# EAGLE design LQFP100 Breakout (EAGLE 6.5.0)
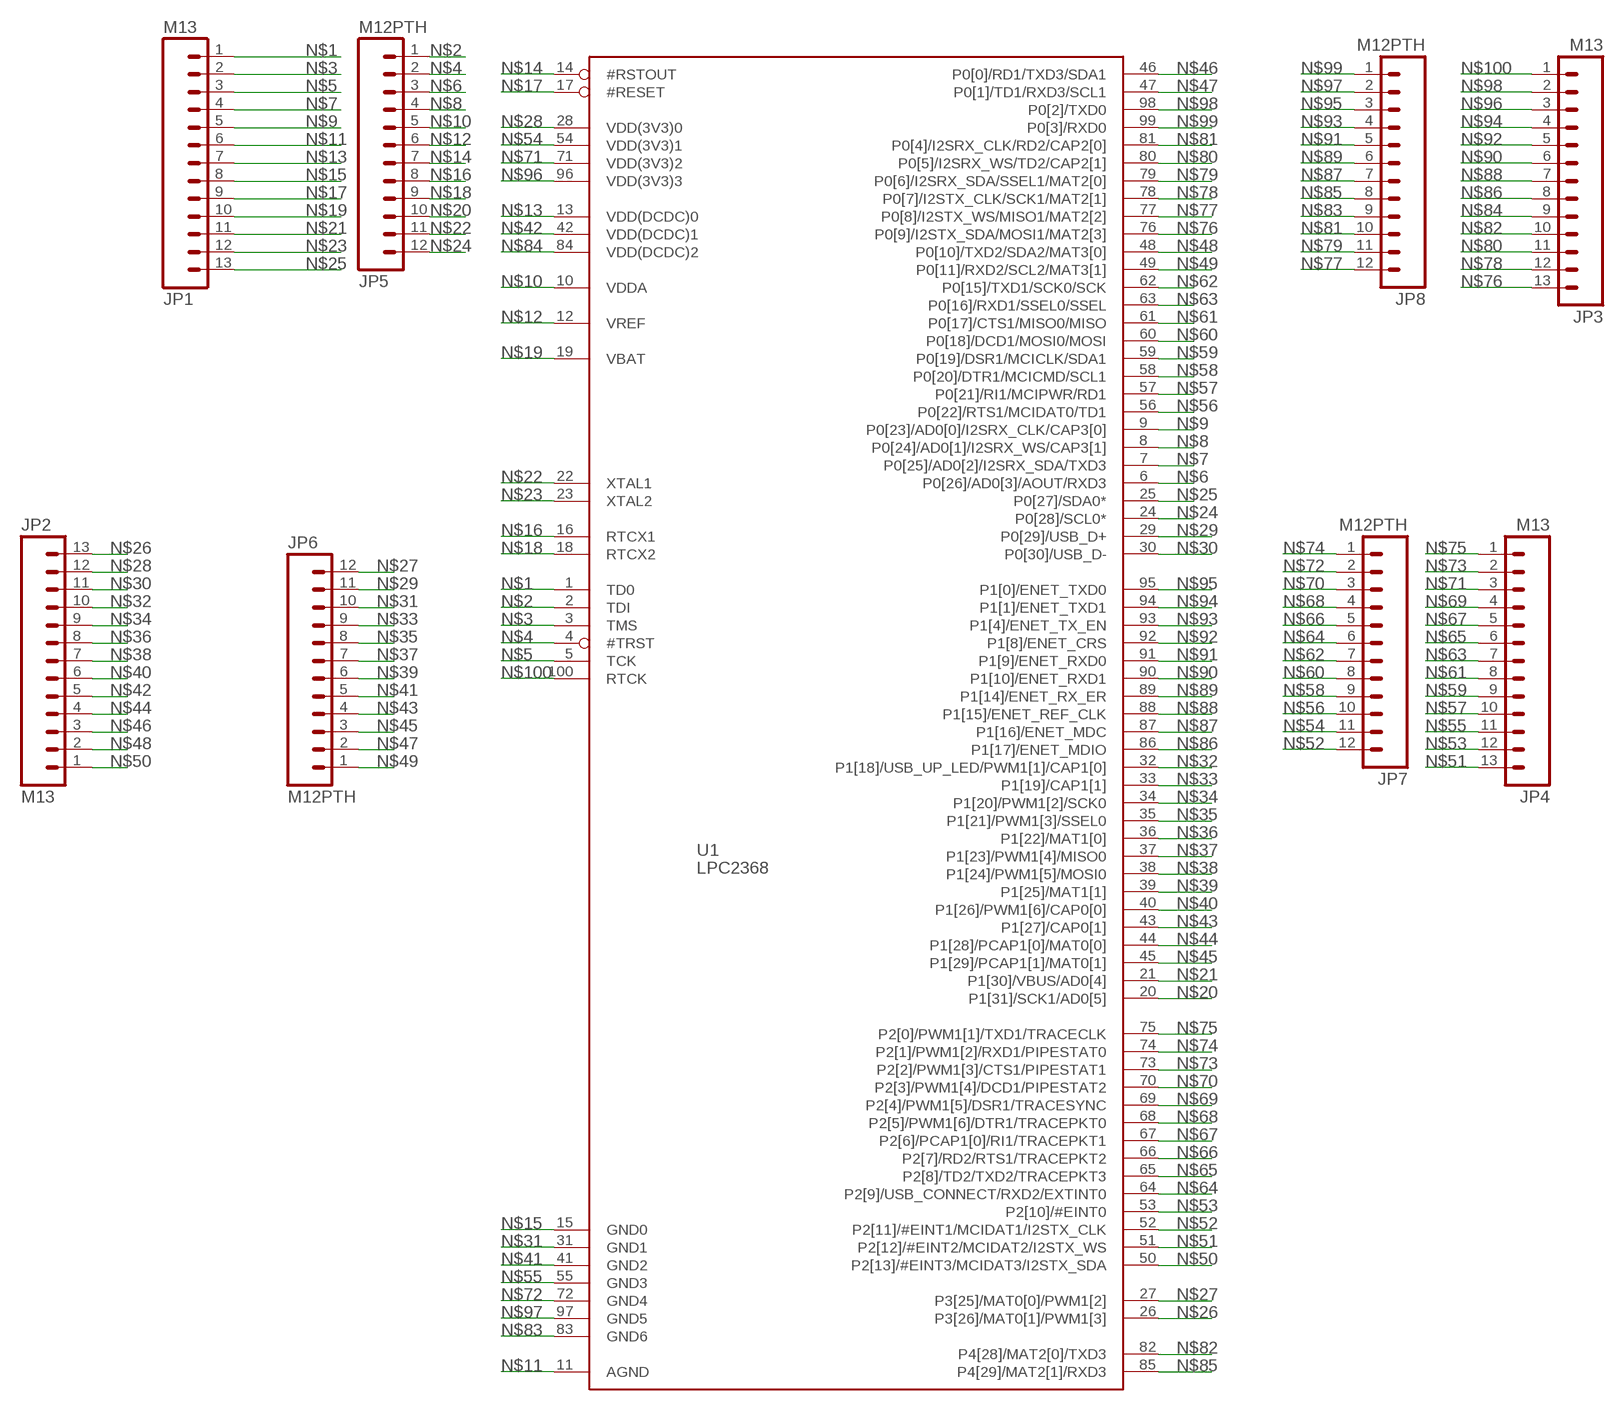
[diagram p0: schematic, sheet 1]

## Parts
JP1  M13  [1X13]
JP2  M13  [1X13]
JP3  M13  [1X13]
JP4  M13  [1X13]
JP5  M12PTH  [1X12]
JP6  M12PTH  [1X12]
JP7  M12PTH  [1X12]
JP8  M12PTH  [1X12]
U1  LPC2368  [LQFP100]

## Nets
N$1: JP1.1 U1.1(TD0)
N$2: JP5.1 U1.2(TDI)
N$3: JP1.2 U1.3(TMS)
N$4: JP5.2 U1.4(#TRST)
N$5: JP1.3 U1.5(TCK)
N$6: JP5.3 U1.6(P0[26]/AD0[3]/AOUT/RXD3)
N$7: JP1.4 U1.7(P0[25]/AD0[2]/I2SRX_SDA/TXD3)
N$8: JP5.4 U1.8(P0[24]/AD0[1]/I2SRX_WS/CAP3[1])
N$9: JP1.5 U1.9(P0[23]/AD0[0]/I2SRX_CLK/CAP3[0])
N$10: JP5.5 U1.10(VDDA)
N$11: JP1.6 U1.11(AGND)
N$12: JP5.6 U1.12(VREF)
N$13: JP1.7 U1.13(VDD(DCDC)0)
N$14: JP5.7 U1.14(#RSTOUT)
N$15: JP1.8 U1.15(GND0)
N$16: JP5.8 U1.16(RTCX1)
N$17: JP1.9 U1.17(#RESET)
N$18: JP5.9 U1.18(RTCX2)
N$19: JP1.10 U1.19(VBAT)
N$20: JP5.10 U1.20(P1[31]/SCK1/AD0[5])
N$21: JP1.11 U1.21(P1[30]/VBUS/AD0[4])
N$22: JP5.11 U1.22(XTAL1)
N$23: JP1.12 U1.23(XTAL2)
N$24: JP5.12 U1.24(P0[28]/SCL0*)
N$25: JP1.13 U1.25(P0[27]/SDA0*)
N$26: JP2.13 U1.26(P3[26]/MAT0[1]/PWM1[3])
N$27: JP6.12 U1.27(P3[25]/MAT0[0]/PWM1[2])
N$28: JP2.12 U1.28(VDD(3V3)0)
N$29: JP6.11 U1.29(P0[29]/USB_D+)
N$30: JP2.11 U1.30(P0[30]/USB_D-)
N$31: JP6.10 U1.31(GND1)
N$32: JP2.10 U1.32(P1[18]/USB_UP_LED/PWM1[1]/CAP1[0])
N$33: JP6.9 U1.33(P1[19]/CAP1[1])
N$34: JP2.9 U1.34(P1[20]/PWM1[2]/SCK0)
N$35: JP6.8 U1.35(P1[21]/PWM1[3]/SSEL0)
N$36: JP2.8 U1.36(P1[22]/MAT1[0])
N$37: JP6.7 U1.37(P1[23]/PWM1[4]/MISO0)
N$38: JP2.7 U1.38(P1[24]/PWM1[5]/MOSI0)
N$39: JP6.6 U1.39(P1[25]/MAT1[1])
N$40: JP2.6 U1.40(P1[26]/PWM1[6]/CAP0[0])
N$41: JP6.5 U1.41(GND2)
N$42: JP2.5 U1.42(VDD(DCDC)1)
N$43: JP6.4 U1.43(P1[27]/CAP0[1])
N$44: JP2.4 U1.44(P1[28]/PCAP1[0]/MAT0[0])
N$45: JP6.3 U1.45(P1[29]/PCAP1[1]/MAT0[1])
N$46: JP2.3 U1.46(P0[0]/RD1/TXD3/SDA1)
N$47: JP6.2 U1.47(P0[1]/TD1/RXD3/SCL1)
N$48: JP2.2 U1.48(P0[10]/TXD2/SDA2/MAT3[0])
N$49: JP6.1 U1.49(P0[11]/RXD2/SCL2/MAT3[1])
N$50: JP2.1 U1.50(P2[13]/#EINT3/MCIDAT3/I2STX_SDA)
N$51: JP4.13 U1.51(P2[12]/#EINT2/MCIDAT2/I2STX_WS)
N$52: JP7.12 U1.52(P2[11]/#EINT1/MCIDAT1/I2STX_CLK)
N$53: JP4.12 U1.53(P2[10]/#EINT0)
N$54: JP7.11 U1.54(VDD(3V3)1)
N$55: JP4.11 U1.55(GND3)
N$56: JP7.10 U1.56(P0[22]/RTS1/MCIDAT0/TD1)
N$57: JP4.10 U1.57(P0[21]/RI1/MCIPWR/RD1)
N$58: JP7.9 U1.58(P0[20]/DTR1/MCICMD/SCL1)
N$59: JP4.9 U1.59(P0[19]/DSR1/MCICLK/SDA1)
N$60: JP7.8 U1.60(P0[18]/DCD1/MOSI0/MOSI)
N$61: JP4.8 U1.61(P0[17]/CTS1/MISO0/MISO)
N$62: JP7.7 U1.62(P0[15]/TXD1/SCK0/SCK)
N$63: JP4.7 U1.63(P0[16]/RXD1/SSEL0/SSEL)
N$64: JP7.6 U1.64(P2[9]/USB_CONNECT/RXD2/EXTINT0)
N$65: JP4.6 U1.65(P2[8]/TD2/TXD2/TRACEPKT3)
N$66: JP7.5 U1.66(P2[7]/RD2/RTS1/TRACEPKT2)
N$67: JP4.5 U1.67(P2[6]/PCAP1[0]/RI1/TRACEPKT1)
N$68: JP7.4 U1.68(P2[5]/PWM1[6]/DTR1/TRACEPKT0)
N$69: JP4.4 U1.69(P2[4]/PWM1[5]/DSR1/TRACESYNC)
N$70: JP7.3 U1.70(P2[3]/PWM1[4]/DCD1/PIPESTAT2)
N$71: JP4.3 U1.71(VDD(3V3)2)
N$72: JP7.2 U1.72(GND4)
N$73: JP4.2 U1.73(P2[2]/PWM1[3]/CTS1/PIPESTAT1)
N$74: JP7.1 U1.74(P2[1]/PWM1[2]/RXD1/PIPESTAT0)
N$75: JP4.1 U1.75(P2[0]/PWM1[1]/TXD1/TRACECLK)
N$76: JP3.13 U1.76(P0[9]/I2STX_SDA/MOSI1/MAT2[3])
N$77: JP8.12 U1.77(P0[8]/I2STX_WS/MISO1/MAT2[2])
N$78: JP3.12 U1.78(P0[7]/I2STX_CLK/SCK1/MAT2[1])
N$79: JP8.11 U1.79(P0[6]/I2SRX_SDA/SSEL1/MAT2[0])
N$80: JP3.11 U1.80(P0[5]/I2SRX_WS/TD2/CAP2[1])
N$81: JP8.10 U1.81(P0[4]/I2SRX_CLK/RD2/CAP2[0])
N$82: JP3.10 U1.82(P4[28]/MAT2[0]/TXD3)
N$83: JP8.9 U1.83(GND6)
N$84: JP3.9 U1.84(VDD(DCDC)2)
N$85: JP8.8 U1.85(P4[29]/MAT2[1]/RXD3)
N$86: JP3.8 U1.86(P1[17]/ENET_MDIO)
N$87: JP8.7 U1.87(P1[16]/ENET_MDC)
N$88: JP3.7 U1.88(P1[15]/ENET_REF_CLK)
N$89: JP8.6 U1.89(P1[14]/ENET_RX_ER)
N$90: JP3.6 U1.90(P1[10]/ENET_RXD1)
N$91: JP8.5 U1.91(P1[9]/ENET_RXD0)
N$92: JP3.5 U1.92(P1[8]/ENET_CRS)
N$93: JP8.4 U1.93(P1[4]/ENET_TX_EN)
N$94: JP3.4 U1.94(P1[1]/ENET_TXD1)
N$95: JP8.3 U1.95(P1[0]/ENET_TXD0)
N$96: JP3.3 U1.96(VDD(3V3)3)
N$97: JP8.2 U1.97(GND5)
N$98: JP3.2 U1.98(P0[2]/TXD0)
N$99: JP8.1 U1.99(P0[3]/RXD0)
N$100: JP3.1 U1.100(RTCK)

## Library data of the parts
JP1-JP4 = SparkFun-Connectors:M13: 13-pin single row .1" header
JP5-JP8 = SparkFun-Connectors:M12: Header 12 Standard 12-pin 0.1" header. Use with straight break away headers (SKU : PRT-00116), right angle break away headers (PRT-00553), swiss pins (PRT-00743), machine pins (PRT-00117), and female headers (PRT-00115).
U1 = KwanSystems:LPC2368

## Board
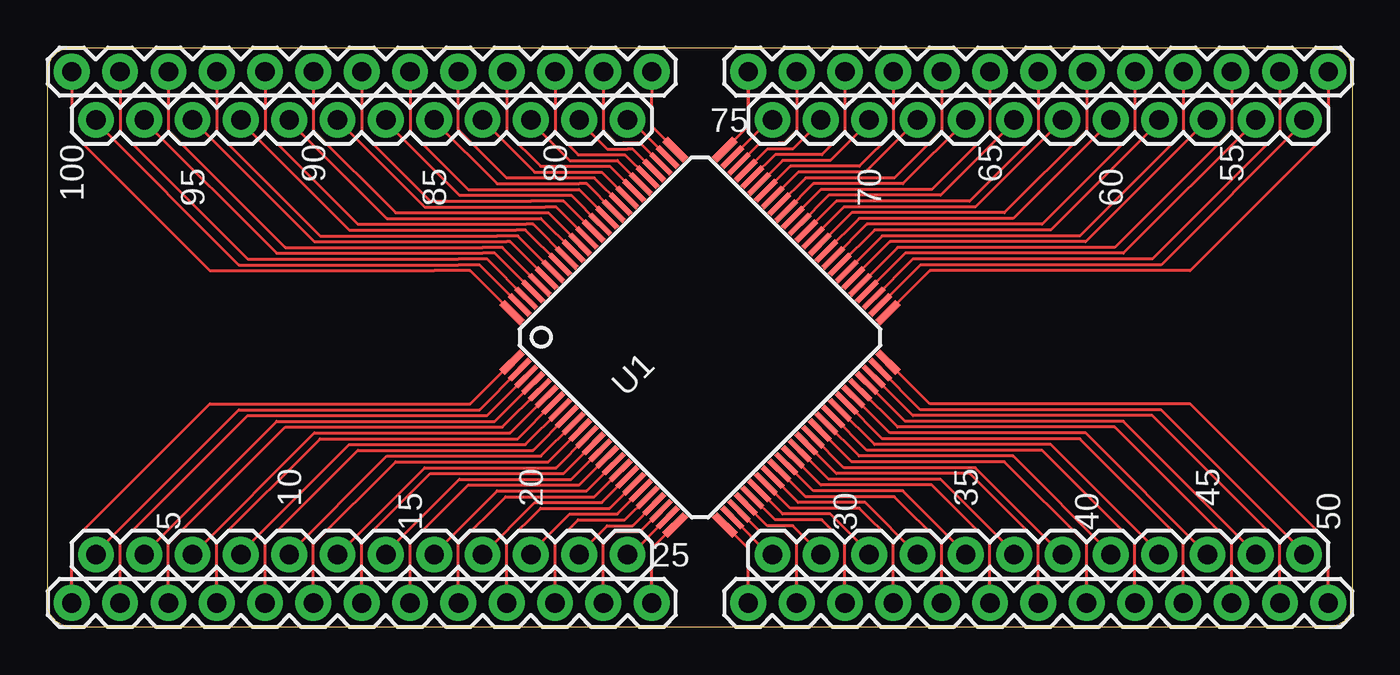
[diagram p1: board, top side]

Size 68.58 x 30.48 mm. Coordinates in mm from the lower left corner, seen from the top.
Outline: 1.27,30.48 67.31,30.48 arc-90 68.58,29.21 68.58,1.27 arc-90 67.31,0 1.27,0 arc-90 0,1.27 0,29.21 arc-90 1.27,30.48
Copper layers (1*16): Top 0.0356mm / dielectric 1.5011mm / Bottom 0.0356mm
Design rules "default": minimum track width 6mil, minimum drill 13mil, track to track 6mil, track to pad 6mil, pad to pad 6mil, via to via 6mil, smd to smd 6mil, copper to edge 15mil, drill to drill 6mil, minimum pad ring 7mil, minimum via ring 7mil, stop-mask expansion 4mil, vias tented up to drill 0mil, thermal gap 10mil

### Footprints (pad centres in the part's own frame; a part is rotated, then mirrored left to right if it is on the bottom)
1X13 = drill 1.016 pad 1.88: 1 0,0; 2 2.54,0; 3 5.08,0; 4 7.62,0; 5 10.16,0; 6 12.7,0; 7 15.24,0; 8 17.78,0; 9 20.32,0; 10 22.86,0; 11 25.4,0; 12 27.94,0; 13 30.48,0
1X12 = drill 1.016 pad 1.88: 1 0,0; 2 2.54,0; 3 5.08,0; 4 7.62,0; 5 10.16,0; 6 12.7,0; 7 15.24,0; 8 17.78,0; 9 20.32,0; 10 22.86,0; 11 25.4,0; 12 27.94,0
LQFP100 = smd 1.5 x 0.4: 1 -7.9,6.06; 25 -7.9,-6.06; 51 7.9,-6.06; 75 7.9,6.06 | smd 1.5 x 0.28: 2 -7.9,5.5; 3 -7.9,5; 4 -7.9,4.5; 5 -7.9,4; 6 -7.9,3.5; 7 -7.9,3; 8 -7.9,2.5; 9 -7.9,2; 10 -7.9,1.5; 11 -7.9,1; 12 -7.9,0.5; 13 -7.9,0; 14 -7.9,-0.5; 15 -7.9,-1; 16 -7.9,-1.5; 17 -7.9,-2; 18 -7.9,-2.5; 19 -7.9,-3; 20 -7.9,-3.5; 21 -7.9,-4; 22 -7.9,-4.5; 23 -7.9,-5; 24 -7.9,-5.5; 52 7.9,-5.5; 53 7.9,-5; 54 7.9,-4.5; 55 7.9,-4; 56 7.9,-3.5; 57 7.9,-3; 58 7.9,-2.5; 59 7.9,-2; 60 7.9,-1.5; 61 7.9,-1; 62 7.9,-0.5; 63 7.9,0; 64 7.9,0.5; 65 7.9,1; 66 7.9,1.5; 67 7.9,2; 68 7.9,2.5; 69 7.9,3; 70 7.9,3.5; 71 7.9,4; 72 7.9,4.5; 73 7.9,5; 74 7.9,5.5 | smd 0.4 x 1.5: 26 -6.06,-7.9; 50 6.06,-7.9; 76 6.06,7.9; 100 -6.06,7.9 | smd 0.28 x 1.5: 27 -5.5,-7.9; 28 -5,-7.9; 29 -4.5,-7.9; 30 -4,-7.9; 31 -3.5,-7.9; 32 -3,-7.9; 33 -2.5,-7.9; 34 -2,-7.9; 35 -1.5,-7.9; 36 -1,-7.9; 37 -0.5,-7.9; 38 0,-7.9; 39 0.5,-7.9; 40 1,-7.9; 41 1.5,-7.9; 42 2,-7.9; 43 2.5,-7.9; 44 3,-7.9; 45 3.5,-7.9; 46 4,-7.9; 47 4.5,-7.9; 48 5,-7.9; 49 5.5,-7.9; 77 5.5,7.9; 78 5,7.9; 79 4.5,7.9; 80 4,7.9; 81 3.5,7.9; 82 3,7.9; 83 2.5,7.9; 84 2,7.9; 85 1.5,7.9; 86 1,7.9; 87 0.5,7.9; 88 0,7.9; 89 -0.5,7.9; 90 -1,7.9; 91 -1.5,7.9; 92 -2,7.9; 93 -2.5,7.9; 94 -3,7.9; 95 -3.5,7.9; 96 -4,7.9; 97 -4.5,7.9; 98 -5,7.9; 99 -5.5,7.9

### Placement (x,y rotation side)
JP1  1.27,1.27 0 top
JP2  67.31,1.27 180 top
JP3  1.27,29.21 0 top
JP4  36.83,29.21 0 top
JP5  2.54,3.81 0 top
JP6  66.04,3.81 180 top
JP7  38.1,26.67 0 top
JP8  2.54,26.67 0 top
U1  34.29,15.24 45 top

### Tracks (layer width: path | path; a pad name or v marks a point on that pad's centre or on a via)
N$1
  Top 0.152: JP1.1 1.27,4.47 8.53,11.73 22.21,11.73 U1.1
N$2
  Top 0.152: JP5.1 2.54,3.91 10.06,11.43 22.7,11.43 U1.2
N$3
  Top 0.152: JP1.2 3.81,4.42 10.52,11.12 23.1,11.12 U1.3
N$4
  Top 0.152: JP5.2 5.08,3.86 12.04,10.82 23.51,10.82 U1.4
N$5
  Top 0.152: JP1.3 6.35,4.37 12.5,10.52 23.91,10.52 U1.5
N$6
  Top 0.152: JP5.3 14.02,10.21 24.31,10.21 U1.6
N$7
  Top 0.152: JP1.4 8.89,4.47 14.33,9.91 24.71,9.91 U1.7
N$8
  Top 0.152: JP5.4 10.16,3.91 15.85,9.6 25.12,9.6 U1.8
N$9
  Top 0.152: JP1.5 11.43,4.42 16.31,9.3 25.52,9.3 U1.9
N$10
  Top 0.152: JP5.5 12.7,3.86 17.83,8.99 25.92,8.99 U1.10
N$11
  Top 0.152: JP1.6 13.97,4.37 18.29,8.69 26.32,8.69 U1.11
N$12
  Top 0.152: JP5.6 19.81,8.38 26.73,8.38 U1.12
N$13
  Top 0.152: JP1.7 16.51,4.47 20.12,8.08 27.13,8.08 U1.13
N$14
  Top 0.152: JP5.7 17.78,3.91 21.64,7.77 27.53,7.77 U1.14
N$15
  Top 0.152: JP1.8 19.05,4.42 22.1,7.47 27.93,7.47 U1.15
N$16
  Top 0.152: JP5.8 20.32,3.86 23.62,7.16 28.33,7.16 U1.16
N$17
  Top 0.152: JP1.9 21.59,4.37 24.08,6.86 28.74,6.86 U1.17
N$18
  Top 0.152: JP5.9 25.6,6.55 29.14,6.55 U1.18
N$19
  Top 0.152: JP1.10 24.13,4.47 25.91,6.25 29.54,6.25 U1.19
N$20
  Top 0.152: JP5.10 25.4,3.91 27.43,5.94 29.94,5.94 U1.20
N$21
  Top 0.152: JP1.11 26.67,4.42 27.89,5.64 30.35,5.64 U1.21
N$22
  Top 0.152: JP5.11 27.94,3.86 29.41,5.33 30.75,5.33 U1.22
N$23
  Top 0.152: JP1.12 29.21,4.37 29.87,5.03 31.15,5.03 U1.23
N$24
  Top 0.152: JP5.12 30.64,3.81 U1.24
N$25
  Top 0.152: JP1.13 31.75,4.13 U1.25
N$26
  Top 0.152: JP2.13 36.83,4.13 U1.26
N$27
  Top 0.152: JP6.12 37.94,3.81 U1.27
N$28
  Top 0.152: JP2.12 39.37,4.37 38.71,5.03 37.43,5.03 U1.28
N$29
  Top 0.152: JP6.11 40.64,3.86 39.17,5.33 37.83,5.33 U1.29
N$30
  Top 0.152: JP2.11 41.91,4.42 40.69,5.64 38.23,5.64 U1.30
N$31
  Top 0.152: JP6.10 43.18,3.91 41.15,5.94 38.64,5.94 U1.31
N$32
  Top 0.152: JP2.10 44.45,4.47 42.67,6.25 39.04,6.25 U1.32
N$33
  Top 0.152: JP6.9 42.98,6.55 39.44,6.55 U1.33
N$34
  Top 0.152: JP2.9 46.99,4.37 44.5,6.86 39.84,6.86 U1.34
N$35
  Top 0.152: JP6.8 48.26,3.86 44.96,7.16 40.25,7.16 U1.35
N$36
  Top 0.152: JP2.8 49.53,4.42 46.48,7.47 40.65,7.47 U1.36
N$37
  Top 0.152: JP6.7 50.8,3.91 46.94,7.77 41.05,7.77 U1.37
N$38
  Top 0.152: JP2.7 52.07,4.47 48.46,8.08 41.45,8.08 U1.38
N$39
  Top 0.152: JP6.6 48.77,8.38 41.85,8.38 U1.39
N$40
  Top 0.152: JP2.6 54.61,4.37 50.29,8.69 42.26,8.69 U1.40
N$41
  Top 0.152: JP6.5 55.88,3.86 50.75,8.99 42.66,8.99 U1.41
N$42
  Top 0.152: JP2.5 57.15,4.42 52.27,9.3 43.06,9.3 U1.42
N$43
  Top 0.152: JP6.4 58.42,3.91 52.73,9.6 43.46,9.6 U1.43
N$44
  Top 0.152: JP2.4 59.69,4.47 54.25,9.91 43.87,9.91 U1.44
N$45
  Top 0.152: JP6.3 54.56,10.21 44.27,10.21 U1.45
N$46
  Top 0.152: JP2.3 62.23,4.37 56.08,10.52 44.67,10.52 U1.46
N$47
  Top 0.152: JP6.2 63.5,3.86 56.54,10.82 45.07,10.82 U1.47
N$48
  Top 0.152: JP2.2 64.77,4.42 58.06,11.12 45.48,11.12 U1.48
N$49
  Top 0.152: JP6.1 66.04,3.91 58.52,11.43 45.88,11.43 U1.49
N$50
  Top 0.152: JP2.1 67.31,4.47 60.05,11.73 46.37,11.73 U1.50
N$51
  Top 0.152: JP4.13 67.31,26.01 60.05,18.75 46.37,18.75 U1.51
N$52
  Top 0.152: JP7.12 66.04,26.57 58.52,19.05 45.88,19.05 U1.52
N$53
  Top 0.152: JP4.12 64.77,26.06 58.06,19.36 45.48,19.36 U1.53
N$54
  Top 0.152: JP7.11 63.5,26.62 56.54,19.66 45.07,19.66 U1.54
N$55
  Top 0.152: JP4.11 62.23,26.11 56.08,19.96 44.67,19.96 U1.55
N$56
  Top 0.152: JP7.10 54.56,20.27 44.27,20.27 U1.56
N$57
  Top 0.152: JP4.10 59.69,26.01 54.25,20.57 43.87,20.57 U1.57
N$58
  Top 0.152: JP7.9 58.42,26.57 52.73,20.88 43.46,20.88 U1.58
N$59
  Top 0.152: JP4.9 57.15,26.06 52.27,21.18 43.06,21.18 U1.59
N$60
  Top 0.152: JP7.8 55.88,26.62 50.75,21.49 42.66,21.49 U1.60
N$61
  Top 0.152: JP4.8 54.61,26.11 50.29,21.79 42.26,21.79 U1.61
N$62
  Top 0.152: JP7.7 48.77,22.1 41.85,22.1 U1.62
N$63
  Top 0.152: JP4.7 52.07,26.01 48.46,22.4 41.45,22.4 U1.63
N$64
  Top 0.152: JP7.6 50.8,26.57 46.94,22.71 41.05,22.71 U1.64
N$65
  Top 0.152: JP4.6 49.53,26.06 46.48,23.01 40.65,23.01 U1.65
N$66
  Top 0.152: JP7.5 48.26,26.62 44.96,23.32 40.25,23.32 U1.66
N$67
  Top 0.152: JP4.5 46.99,26.11 44.5,23.62 39.84,23.62 U1.67
N$68
  Top 0.152: JP7.4 42.98,23.93 39.44,23.93 U1.68
N$69
  Top 0.152: JP4.4 44.45,26.01 42.67,24.23 39.04,24.23 U1.69
N$70
  Top 0.152: JP7.3 43.18,26.57 41.15,24.54 38.64,24.54 U1.70
N$71
  Top 0.152: JP4.3 41.91,26.06 40.69,24.84 38.23,24.84 U1.71
N$72
  Top 0.152: JP7.2 40.64,26.62 39.17,25.15 37.83,25.15 U1.72
N$73
  Top 0.152: JP4.2 39.37,26.11 38.71,25.45 38.41,25.45 37.43,25.45 U1.73
N$74
  Top 0.152: U1.74 37.94,26.67 JP7.1
N$75
  Top 0.152: 36.83,26.31 JP4.1 36.83,26.35 U1.75
N$76
  Top 0.152: JP3.13 31.75,27.94 31.75,26.35 U1.76
N$77
  Top 0.152: U1.77 30.64,26.67 JP8.12
N$78
  Top 0.152: JP3.12 29.21,26.11 29.87,25.45 30.23,25.45 31.15,25.45 U1.78
N$79
  Top 0.152: JP8.11 27.94,26.62 29.41,25.15 30.48,25.15 30.75,25.15 U1.79
N$80
  Top 0.152: JP3.11 26.67,26.06 27.89,24.84 30.35,24.84 U1.80
N$81
  Top 0.152: JP8.10 25.4,26.57 27.43,24.54 29.94,24.54 U1.81
N$82
  Top 0.152: JP3.10 24.13,26.01 25.91,24.23 29.54,24.23 U1.82
N$83
  Top 0.152: JP8.9 25.6,23.93 29.14,23.93 U1.83
N$84
  Top 0.152: U1.84 28.74,23.62 24.13,23.62 21.59,26.16 JP3.9
N$85
  Top 0.152: JP8.8 20.32,26.62 23.62,23.32 27.94,23.32 28.33,23.32 U1.85
N$86
  Top 0.152: JP3.8 19.05,26.06 22.1,23.01 27.93,23.01 U1.86
N$87
  Top 0.152: JP8.7 17.78,26.57 21.64,22.71 27.53,22.71 U1.87
N$88
  Top 0.152: JP3.7 16.51,26.01 20.12,22.4 25.4,22.4 27.13,22.4 U1.88
N$89
  Top 0.152: JP8.6 19.81,22.1 26.16,22.1 26.73,22.1 U1.89
N$90
  Top 0.152: JP3.6 13.97,26.11 18.29,21.79 26.32,21.79 U1.90
N$91
  Top 0.152: JP8.5 12.7,26.62 17.83,21.49 25.92,21.49 U1.91
N$92
  Top 0.152: JP3.5 11.43,26.06 16.31,21.18 25.15,21.18 25.52,21.18 U1.92
N$93
  Top 0.152: JP8.4 10.16,26.57 15.85,20.88 24.64,20.88 25.12,20.88 U1.93
N$94
  Top 0.152: JP3.4 8.89,26.01 14.33,20.57 23.62,20.57 24.71,20.57 U1.94
N$95
  Top 0.152: JP8.3 14.02,20.27 24.13,20.27 24.31,20.27 U1.95
N$96
  Top 0.152: JP3.3 6.35,26.11 12.5,19.96 22.86,19.96 23.91,19.96 U1.96
N$97
  Top 0.152: JP8.2 5.08,26.62 12.04,19.66 22.86,19.66 23.51,19.66 U1.97
N$98
  Top 0.152: JP3.2 3.81,26.06 10.52,19.36 21.59,19.36 23.1,19.36 U1.98
N$99
  Top 0.152: JP8.1 2.54,26.57 10.06,19.05 21.59,19.05 22.7,19.05 U1.99
N$100
  Top 0.152: JP3.1 1.27,26.01 8.53,18.75 20.32,18.75 22.21,18.75 U1.100

### Text on the board
tPlace: 75 | 100 | 90 | 80 | 65 | 55 | 95 | 85 | 70 | 60 | 10 | 20 | 35 | 45 | 5 | 15 | 30 | 40 | 50 | 25